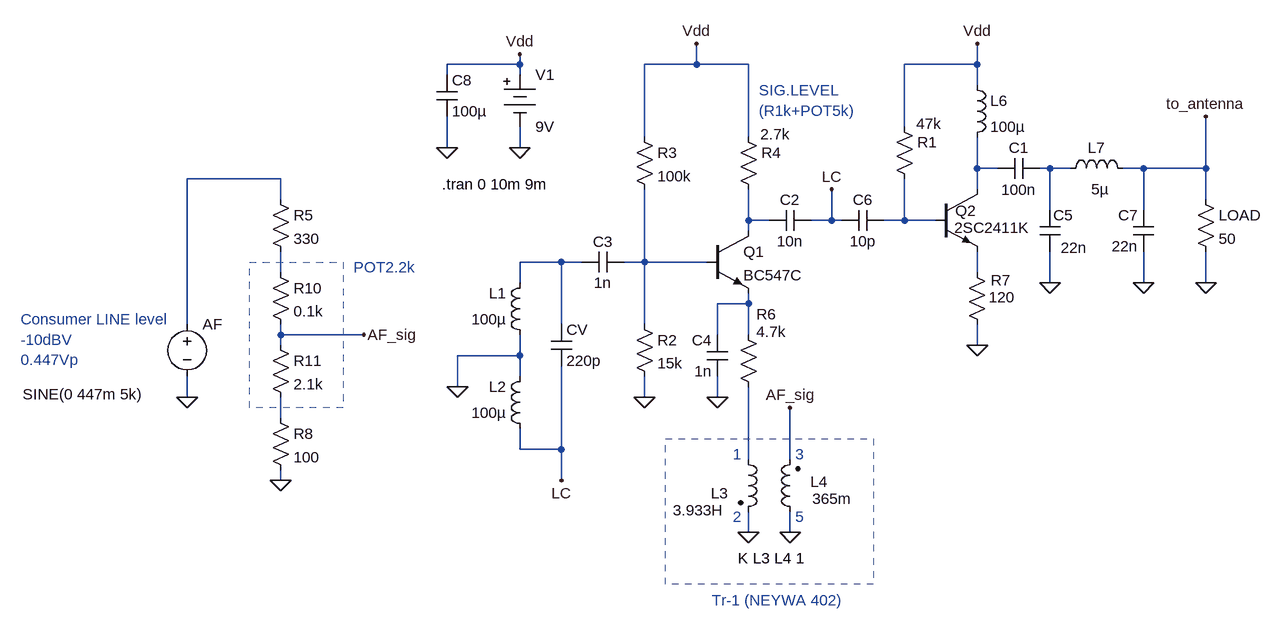
[diagram p0: schematic mw-rf-transmitter-01.asc]
mw-rf-transmitter-01.asc, the LTspice schematic file:
Version 4
SHEET 1 1632 824
WIRE 272 -16 272 -32
WIRE 272 -16 160 -16
WIRE 544 -16 544 -48
WIRE 544 -16 464 -16
WIRE 624 -16 544 -16
WIRE 976 -16 976 -48
WIRE 976 -16 864 -16
WIRE 160 0 160 -16
WIRE 272 0 272 -16
WIRE 976 16 976 -16
WIRE 864 80 864 -16
WIRE 464 96 464 -16
WIRE 624 96 624 -16
WIRE 160 112 160 64
WIRE 272 112 272 80
WIRE 976 144 976 96
WIRE 1008 144 976 144
WIRE 1088 144 1072 144
WIRE 1120 144 1088 144
WIRE 1232 144 1200 144
WIRE 1328 144 1328 64
WIRE 1328 144 1232 144
WIRE -96 160 -240 160
WIRE 976 176 976 144
WIRE -96 192 -96 160
WIRE 1328 192 1328 144
WIRE 1088 208 1088 144
WIRE 1232 208 1232 144
WIRE 624 224 624 176
WIRE 656 224 624 224
WIRE 752 224 752 176
WIRE 752 224 720 224
WIRE 768 224 752 224
WIRE 864 224 864 160
WIRE 864 224 832 224
WIRE 912 224 864 224
WIRE 624 240 624 224
WIRE 336 288 272 288
WIRE 368 288 336 288
WIRE 464 288 464 176
WIRE 464 288 432 288
WIRE 560 288 464 288
WIRE -96 304 -96 272
WIRE 976 304 976 272
WIRE 272 320 272 288
WIRE 1088 320 1088 272
WIRE 1232 320 1232 272
WIRE 1328 320 1328 272
WIRE 624 352 624 336
WIRE 624 352 576 352
WIRE -240 384 -240 160
WIRE 336 384 336 288
WIRE 464 384 464 288
WIRE -96 400 -96 384
WIRE 32 400 -96 400
WIRE 576 400 576 352
WIRE 624 400 624 352
WIRE -96 416 -96 400
WIRE 976 416 976 384
WIRE 272 432 272 400
WIRE 272 432 176 432
WIRE 272 464 272 432
WIRE 176 480 176 432
WIRE -240 496 -240 464
WIRE 464 496 464 464
WIRE 576 496 576 464
WIRE -96 528 -96 496
WIRE 272 576 272 544
WIRE 336 576 336 448
WIRE 336 576 272 576
WIRE 624 592 624 480
WIRE 688 592 688 512
WIRE -96 624 -96 608
WIRE 336 624 336 576
WIRE 624 704 624 672
WIRE 688 704 688 672
FLAG 624 704 0
FLAG 176 480 0
FLAG 544 -48 Vdd
FLAG 272 112 0
FLAG 272 -32 Vdd
FLAG -240 496 0
FLAG 336 624 LC
FLAG 752 176 LC
FLAG 688 512 AF_sig
FLAG 688 704 0
FLAG 464 496 0
FLAG 576 496 0
FLAG 976 416 0
FLAG 976 -48 Vdd
FLAG 1328 320 0
FLAG 1088 320 0
FLAG 1232 320 0
FLAG 32 400 AF_sig
FLAG -96 624 0
FLAG 160 112 0
FLAG 1328 64 to_antenna
SYMBOL npn 560 240 R0
SYMATTR InstName Q1
SYMATTR Value BC547C
SYMBOL ind 288 416 R180
WINDOW 0 36 80 Left 2
WINDOW 3 36 40 Left 2
SYMATTR InstName L1
SYMATTR Value 100µ
SYMBOL ind 288 560 R180
WINDOW 0 36 80 Left 2
WINDOW 3 36 40 Left 2
SYMATTR InstName L2
SYMATTR Value 100µ
SYMBOL cap 320 384 R0
SYMATTR InstName CV
SYMATTR Value 220p
SYMBOL cap 432 272 R90
WINDOW 0 0 32 VBottom 2
WINDOW 3 32 32 VTop 2
SYMATTR InstName C3
SYMATTR Value 1n
SYMBOL Misc\\battery 272 -16 R0
WINDOW 123 0 0 Left 0
WINDOW 39 0 0 Left 0
SYMATTR InstName V1
SYMATTR Value 9V
SYMBOL res 448 368 R0
SYMATTR InstName R2
SYMATTR Value 15k
SYMBOL res 448 80 R0
SYMATTR InstName R3
SYMATTR Value 100k
SYMBOL res 608 80 R0
WINDOW 3 34 11 Left 2
SYMATTR Value 2.7k
SYMATTR InstName R4
SYMBOL cap 720 208 R90
WINDOW 0 0 32 VBottom 2
WINDOW 3 32 32 VTop 2
SYMATTR InstName C2
SYMATTR Value 10n
SYMBOL res 608 384 R0
WINDOW 0 28 -16 Left 2
WINDOW 3 28 11 Left 2
SYMATTR InstName R6
SYMATTR Value 4.7k
SYMBOL cap 592 464 R180
WINDOW 0 24 56 Left 2
WINDOW 3 24 8 Left 2
SYMATTR InstName C4
SYMATTR Value 1n
SYMBOL voltage -240 368 R0
WINDOW 123 0 0 Left 0
WINDOW 39 0 0 Left 0
WINDOW 3 -253 123 Left 2
SYMATTR Value SINE(0 447m 5k)
SYMATTR InstName AF
SYMBOL ind2 608 576 R0
WINDOW 0 -42 68 Left 2
WINDOW 3 -100 94 Left 2
SYMATTR InstName L3
SYMATTR Value 3.933H
SYMATTR Type ind
SYMBOL ind2 704 688 R180
WINDOW 0 -42 62 Left 2
WINDOW 3 -79 36 Left 2
SYMATTR InstName L4
SYMATTR Value 365m
SYMATTR Type ind
SYMBOL npn 912 176 R0
WINDOW 0 30 33 Left 2
WINDOW 3 29 59 Left 2
SYMATTR InstName Q2
SYMATTR Value 2SC2411K
SYMBOL res 1312 176 R0
SYMATTR InstName LOAD
SYMATTR Value 50
SYMBOL ind 960 0 R0
SYMATTR InstName L6
SYMATTR Value 100µ
SYMBOL cap 1072 128 R90
WINDOW 0 0 32 VBottom 2
WINDOW 3 33 32 VTop 2
SYMATTR InstName C1
SYMATTR Value 100n
SYMBOL ind 1104 160 R270
WINDOW 0 32 56 VTop 2
WINDOW 3 0 61 VBottom 2
SYMATTR InstName L7
SYMATTR Value 5µ
SYMBOL cap 1104 272 R180
WINDOW 0 -20 56 Left 2
WINDOW 3 -41 6 Left 2
SYMATTR InstName C5
SYMATTR Value 22n
SYMBOL cap 832 208 R90
WINDOW 0 0 32 VBottom 2
WINDOW 3 32 32 VTop 2
SYMATTR InstName C6
SYMATTR Value 10p
SYMBOL cap 1248 272 R180
WINDOW 0 24 56 Left 2
WINDOW 3 24 8 Left 2
SYMATTR InstName C7
SYMATTR Value 22n
SYMBOL res 848 64 R0
WINDOW 3 34 11 Left 2
SYMATTR Value 47k
SYMATTR InstName R1
SYMBOL res -112 176 R0
SYMATTR InstName R5
SYMATTR Value 330
SYMBOL res -112 512 R0
SYMATTR InstName R8
SYMATTR Value 100
SYMBOL res -112 288 R0
SYMATTR InstName R10
SYMATTR Value 0.1k
SYMBOL res -112 400 R0
SYMATTR InstName R11
SYMATTR Value 2.1k
SYMBOL cap 144 0 R0
SYMATTR InstName C8
SYMATTR Value 100µ
SYMBOL res 960 288 R0
WINDOW 0 37 28 Left 2
WINDOW 3 34 54 Left 2
SYMATTR InstName R7
SYMATTR Value 120
TEXT 152 168 Left 2 !.tran 0 10m 9m
TEXT 608 744 Left 2 !K L3 L4 1
TEXT 640 24 Left 2 ;SIG.LEVEL \n(R1k+POT5k)
TEXT 696 584 Left 2 ;3
TEXT 696 680 Left 2 ;5
TEXT 600 584 Left 2 ;1
TEXT 600 680 Left 2 ;2
TEXT 568 808 Left 2 ;Tr-1 (NEYWA 402)
TEXT -496 376 Left 2 ;Consumer LINE level\n-10dBV\n0.447Vp
TEXT 16 296 Left 2 ;POT2.2k
RECTANGLE Normal 0 512 -144 288 2
RECTANGLE Normal 816 784 496 560 2

The netlist it stands for:
* mw-rf-transmitter-01.asc
Q1 N004 N007 N010 0 BC547C
L1 0 N006 100µ
L2 LC 0 100µ
CV N006 LC 220p
C3 N007 N006 1n
V1 Vdd 0 9V
R2 N007 0 15k
R3 Vdd N007 100k
R4 Vdd N004 2.7k
C2 LC N004 10n
R6 N010 N012 4.7k
C4 0 N010 1n
V§AF N003 0 SINE(0 447m 5k)
L3 N012 0 3.933H
L4 0 AF_sig 365m
Q2 N001 N005 N009 0 2SC2411K
R§LOAD to_antenna 0 50
L6 Vdd N001 100µ
C1 N002 N001 100n
L7 N002 to_antenna 5µ
C5 0 N002 22n
C6 N005 LC 10p
C7 0 to_antenna 22n
R1 Vdd N005 47k
R5 N003 N008 330
R8 N011 0 100
R10 N008 AF_sig 0.1k
R11 AF_sig N011 2.1k
C8 Vdd 0 100µ
R7 N009 0 120
.model NPN NPN
.model PNP PNP
.lib standard.bjt
.tran 0 10m 9m
K L3 L4 1
* SIG.LEVEL
* (R1k+POT5k)
* 3
* 5
* 1
* 2
* Tr-1 (NEYWA 402)
* Consumer LINE level
* -10dBV
* 0.447Vp
* POT2.2k
.backanno
.end